# EAGLE design femtoUSB_r1.0.0_TQFP_BREADBOARD (EAGLE 6.5.0)
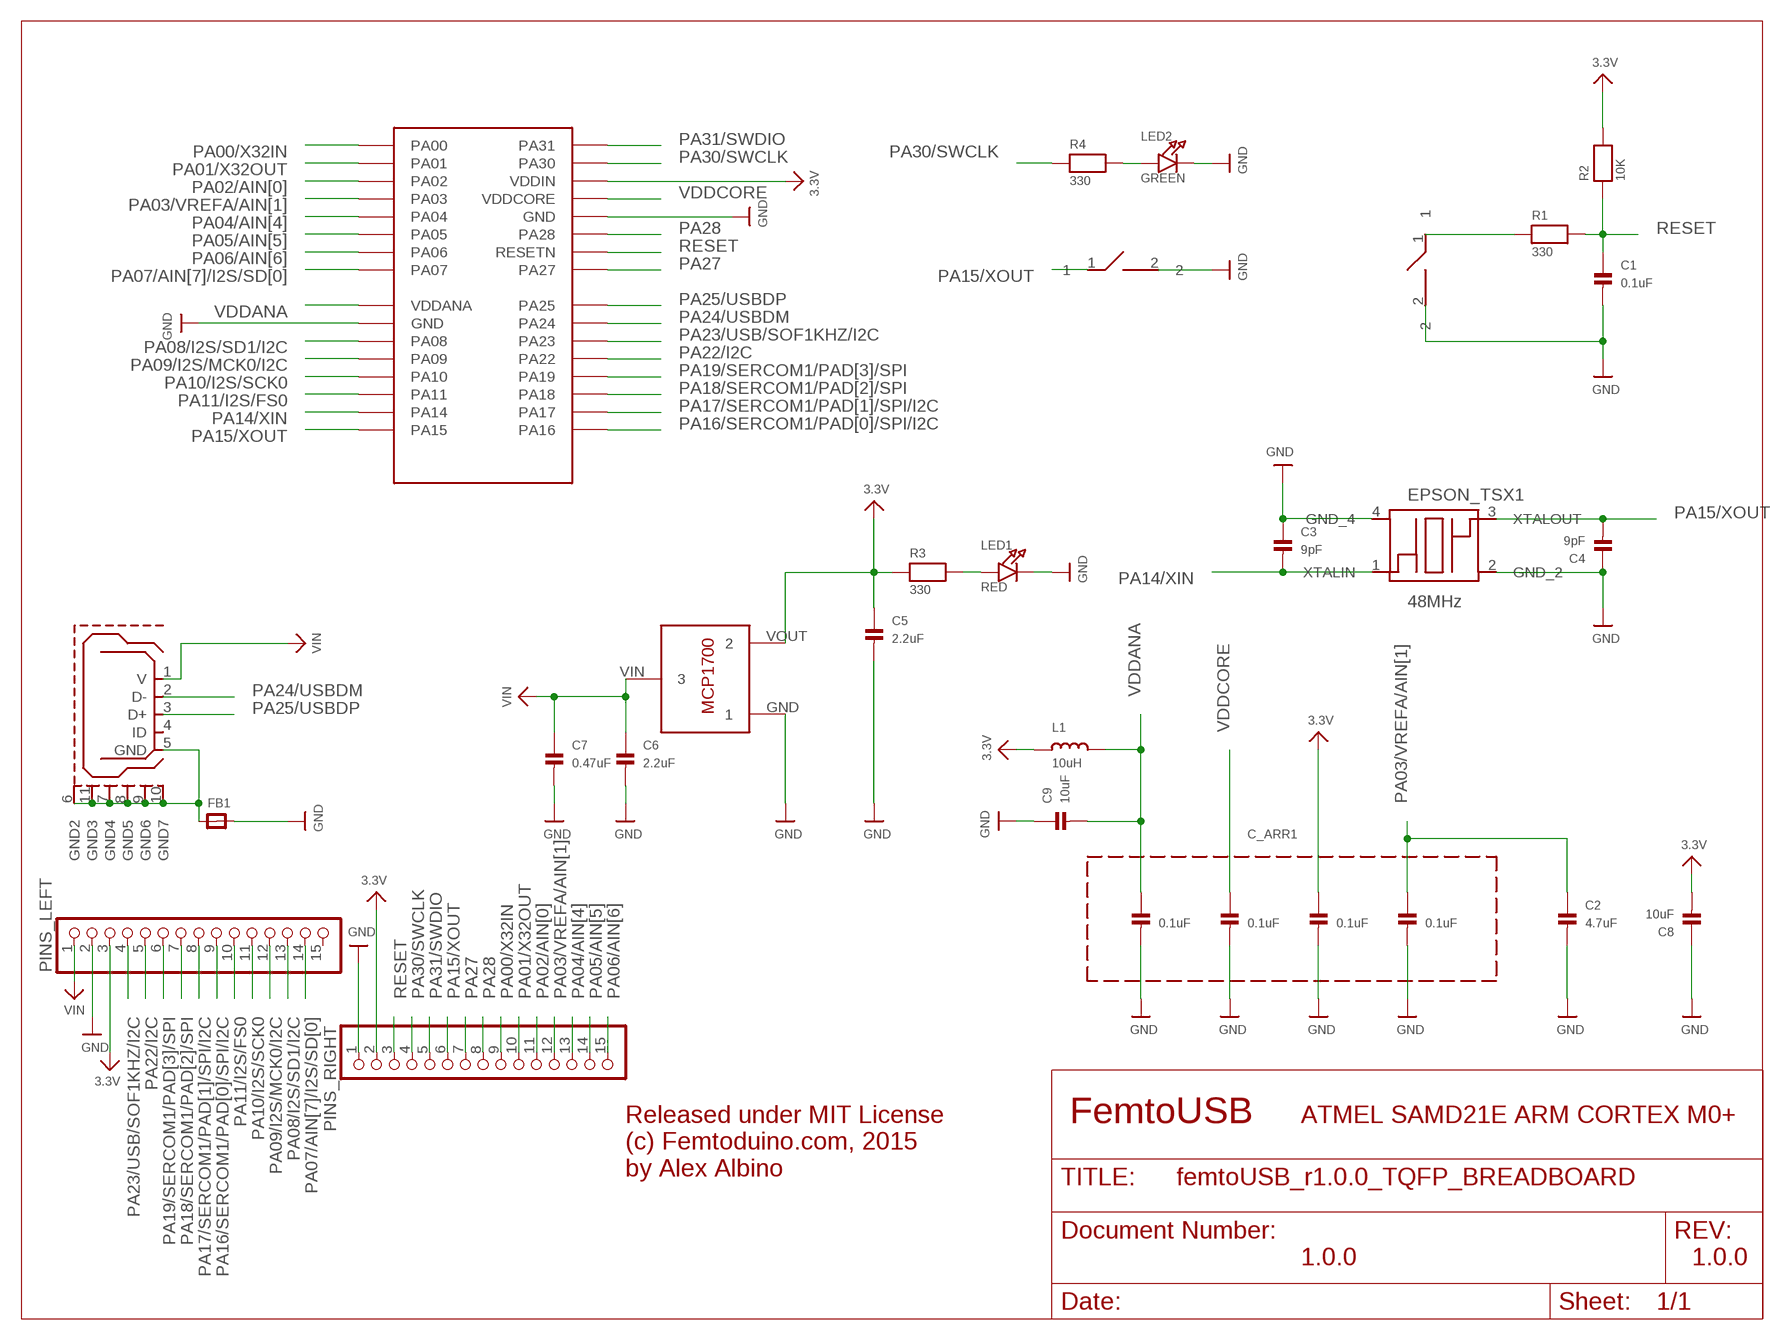
[diagram p0: schematic, sheet 1]

## Parts
BTN  OMRON B3U-300P(M)  SPST_SMD  [SPST_SMD]
C1  0.1uF  CAP_CERAMIC_0402MP  [_0402MP]
C2  4.7uF  CAP_CERAMIC_0402MP  [_0402MP]
C3  9pF  CAP_CERAMIC_0402MP  [_0402MP]
C4  9pF  CAP_CERAMIC_0402MP  [_0402MP]
C5  2.2uF  CAP_CERAMIC_0402MP  [_0402MP]
C6  2.2uF  CAP_CERAMIC_0402MP  [_0402MP]
C7  0.47uF  CAP_CERAMIC_0402MP  [_0402MP]
C8  10uF  CAP_CERAMIC_0402MP  [_0402MP]
C9  10uF  CAP_CERAMIC_0402MP  [_0402MP]
C_ARR1  0.1uF  KEMET_CERAMIC_CAPACITOR_ARRAY_1X4  [CAPACITOR_ARRAY_1206_MONO_1X4]
EPSON_TSX1  48MHz  TSX-3225  [TSX-3225]
FB1  FERRITE_0603MP  [_0603MP]
IC1  ATSAMD21E18A-AU  [32-TQFP]
L1  10uH  INDUCTOR_0603MP  [_0603MP]
LDO_VREG  MCP1700T-3302E/TT  [MCP1700T-3302E/TT]
LED1  RED  LED0603_NOOUTLINE  [CHIPLED_0603_NOOUTLINE]
LED2  GREEN  LED0603_NOOUTLINE  [CHIPLED_0603_NOOUTLINE]
MICRO_B_USB  USB_MICROB  [USB_MICROB_PACKAGE]
PINS_LEFT  HEADER-1X15  [1X15_ROUND_70]
PINS_RIGHT  HEADER-1X15  [1X15_ROUND_70]
R1  330  RESISTOR_0402MP  [_0402MP]
R2  10K  RESISTOR_0402MP  [_0402MP]
R3  330  RESISTOR_0402MP  [_0402MP]
R4  330  RESISTOR_0402MP  [_0402MP]
U$38  SPST_SMD  [SPST_SMD]

## Nets
3.3V: C5.1 C8.2 C_ARR1.5 IC1.30(VDDIN) L1.1 LDO_VREG.VOUT PINS_LEFT.3 PINS_RIGHT.2 R2.2 R3.1
GND: BTN.2 C1.2 C2.2 C3.1 C4.1 C5.2 C6.2 C7.2 C8.1 C9.1 C_ARR1.2 C_ARR1.4 C_ARR1.6 C_ARR1.8 EPSON_TSX1.2(GND_2) EPSON_TSX1.4(GND_4) FB1.2 IC1.10(GND) IC1.28(GND) LDO_VREG.GND LED1.C LED2.C PINS_LEFT.2 PINS_RIGHT.1 U$38.2
N$1: LED1.A R3.2
N$13: LED2.A R4.2
N$26: BTN.1 R1.1
N$32: FB1.1 MICRO_B_USB.5(GND) MICRO_B_USB.6(GND2) MICRO_B_USB.7(GND4) MICRO_B_USB.8(GND5) MICRO_B_USB.9(GND6) MICRO_B_USB.10(GND7) MICRO_B_USB.11(GND3)
PA00/X32IN: IC1.1(PA00) PINS_RIGHT.9
PA01/X32OUT: IC1.2(PA01) PINS_RIGHT.10
PA02/AIN[0]: IC1.3(PA02) PINS_RIGHT.11
PA03/VREFA/AIN[1]: C2.1 C_ARR1.7 IC1.4(PA03) PINS_RIGHT.12
PA04/AIN[4]: IC1.5(PA04) PINS_RIGHT.13
PA05/AIN[5]: IC1.6(PA05) PINS_RIGHT.14
PA06/AIN[6]: IC1.7(PA06) PINS_RIGHT.15
PA07/AIN[7]/I2S/SD[0]: IC1.8(PA07) PINS_LEFT.14
PA08/I2S/SD1/I2C: IC1.11(PA08) PINS_LEFT.13
PA09/I2S/MCK0/I2C: IC1.12(PA09) PINS_LEFT.12
PA10/I2S/SCK0: IC1.13(PA10) PINS_LEFT.11
PA11/I2S/FS0: IC1.14(PA11) PINS_LEFT.10
PA14/XIN: C3.2 EPSON_TSX1.1(XTALIN) IC1.15(PA14)
PA15/XOUT: C4.2 EPSON_TSX1.3(XTALOUT) IC1.16(PA15) PINS_RIGHT.6 U$38.1
PA16/SERCOM1/PAD[0]/SPI/I2C: IC1.17(PA16) PINS_LEFT.9
PA17/SERCOM1/PAD[1]/SPI/I2C: IC1.18(PA17) PINS_LEFT.8
PA18/SERCOM1/PAD[2]/SPI: IC1.19(PA18) PINS_LEFT.7
PA19/SERCOM1/PAD[3]/SPI: IC1.20(PA19) PINS_LEFT.6
PA22/I2C: IC1.21(PA22) PINS_LEFT.5
PA23/USB/SOF1KHZ/I2C: IC1.22(PA23) PINS_LEFT.4
PA24/USBDM: IC1.23(PA24) MICRO_B_USB.2(D-)
PA25/USBDP: IC1.24(PA25) MICRO_B_USB.3(D+)
PA27: IC1.25(PA27) PINS_RIGHT.7
PA28: IC1.27(PA28) PINS_RIGHT.8
PA30/SWCLK: IC1.31(PA30) PINS_RIGHT.4 R4.1
PA31/SWDIO: IC1.32(PA31) PINS_RIGHT.5
RESET: C1.1 IC1.26(RESETN) PINS_RIGHT.3 R1.2 R2.1
VDDANA: C9.2 C_ARR1.1 IC1.9(VDDANA) L1.2
VDDCORE: C_ARR1.3 IC1.29(VDDCORE)
VIN: C6.1 C7.1 LDO_VREG.VIN MICRO_B_USB.1(V) PINS_LEFT.1
Unconnected: MICRO_B_USB.4(ID) PINS_LEFT.15

## Notes on the sheet
- FemtoUSB | ATMEL SAMD21E ARM CORTEX M0+
- Released under MIT License
  (c) Femtoduino.com, 2015
  by Alex Albino
- 1.0.0 | 1.0.0

## Library data of the parts
BTN U$38 = femtoduino:SPST_SMD
C1 = microbuilder:CAP_CERAMIC: Ceramic Capacitors 0402 - 0402 Surface Mount Capacitors 16pF 50V 5% [Digikey: 445-4899-2-ND] 18pF 50V 5% [Digikey: 490-1281-2-ND] 22pF 50V 5% [Digikey: 490-1283-2-ND] 68pF 50V 5% [Digikey: 490-1289-2-ND] 0.1uF 10V 10% [Digikey: 490-1318-2-ND] 1.0uF 6.3V 10% [Digikey: 490-1320-2-ND] 0603 - 0603 Surface Mount Capacitors 16 pF 50V 5% [Digikey: 445-5051-2-ND] 22 pF 50V [Digikey: PCC220ACVTR-ND] 33 pF 50V 5% [Digikey: 490-1415-1-ND] 56pF 50V 5% [Digikey: 490-1421-1-ND] 220pF 50V 5% [Digikey: 445-1285-1-ND] 680 pF 50V 2200 pF 50V 5% C0G [Digikey: 445-1297-1-ND] 5600 pF 100V 5% X7R [Digikey: 478-3711-1-ND] 0.1 µF 25V 10% [Digikey: PCC2277TR-ND] 0.22 µF 16V 10% X7R [Digikey: 445-1318-1-ND] 1.0 µF 25V 10% [Digikey: 445-5146-2-ND] 0603 - RF Specific 3pF 250V +/-0.1pF RF [Digikey: 712-1347-1-ND] 18 pF 250V 5% [Digikey: 478-3505-1-ND or 712-1322-1-ND] 56 pF 250V 5% C0G RF [Digikey: 490-4867-1-ND] 68 pF 250V RF [Digikey: 490-4868-1-ND] 0805 - 0805 Surface Mount Capacitors 220 pF 250V 2% RF Ceramic Capacitor [Digikey: 712-1398-1-ND] 1000 pF 50V 2% NP0 Ceramic Capacitor [Digikey: 478-3760-1-ND] 0.1 µF 25V 10% Ceramic Capacitor [Digikey: PCC1828TR-ND] 1.0 µF 16V 10% Ceramic Capacitor[Digikey: 490-1691-2-ND] 10.0 µF 10V 10% Ceramic Capacitor[Digikey: 709-1228-1-ND] 10.0 uF 16V 10% Ceramic Capacitor [Digikey: 478-5165-2-ND] 47 uF 6.3V 20% Ceramic Capacitor [Digikey: 587-1779-1-ND or 399-5506-1-ND] 1206 - 1206 Surface Mount Capacitors 47uF 10V 20% Ceramic Capacitor [Digikey: 490-5528-1-ND or 399-5508-1-ND or 445-6010-1-ND] 100uF 6.3V -20%, +80% Y5V Ceramic Capacitor (Digikey: 490-4512-1-ND, Mouser: 81-GRM31CF50J107ZE1L); DIGIKEY_PART: 445-4958-1-ND
C2-C9 = microbuilder:CAP_CERAMIC: Ceramic Capacitors 0402 - 0402 Surface Mount Capacitors 16pF 50V 5% [Digikey: 445-4899-2-ND] 18pF 50V 5% [Digikey: 490-1281-2-ND] 22pF 50V 5% [Digikey: 490-1283-2-ND] 68pF 50V 5% [Digikey: 490-1289-2-ND] 0.1uF 10V 10% [Digikey: 490-1318-2-ND] 1.0uF 6.3V 10% [Digikey: 490-1320-2-ND] 0603 - 0603 Surface Mount Capacitors 16 pF 50V 5% [Digikey: 445-5051-2-ND] 22 pF 50V [Digikey: PCC220ACVTR-ND] 33 pF 50V 5% [Digikey: 490-1415-1-ND] 56pF 50V 5% [Digikey: 490-1421-1-ND] 220pF 50V 5% [Digikey: 445-1285-1-ND] 680 pF 50V 2200 pF 50V 5% C0G [Digikey: 445-1297-1-ND] 5600 pF 100V 5% X7R [Digikey: 478-3711-1-ND] 0.1 µF 25V 10% [Digikey: PCC2277TR-ND] 0.22 µF 16V 10% X7R [Digikey: 445-1318-1-ND] 1.0 µF 25V 10% [Digikey: 445-5146-2-ND] 0603 - RF Specific 3pF 250V +/-0.1pF RF [Digikey: 712-1347-1-ND] 18 pF 250V 5% [Digikey: 478-3505-1-ND or 712-1322-1-ND] 56 pF 250V 5% C0G RF [Digikey: 490-4867-1-ND] 68 pF 250V RF [Digikey: 490-4868-1-ND] 0805 - 0805 Surface Mount Capacitors 220 pF 250V 2% RF Ceramic Capacitor [Digikey: 712-1398-1-ND] 1000 pF 50V 2% NP0 Ceramic Capacitor [Digikey: 478-3760-1-ND] 0.1 µF 25V 10% Ceramic Capacitor [Digikey: PCC1828TR-ND] 1.0 µF 16V 10% Ceramic Capacitor[Digikey: 490-1691-2-ND] 10.0 µF 10V 10% Ceramic Capacitor[Digikey: 709-1228-1-ND] 10.0 uF 16V 10% Ceramic Capacitor [Digikey: 478-5165-2-ND] 47 uF 6.3V 20% Ceramic Capacitor [Digikey: 587-1779-1-ND or 399-5506-1-ND] 1206 - 1206 Surface Mount Capacitors 47uF 10V 20% Ceramic Capacitor [Digikey: 490-5528-1-ND or 399-5508-1-ND or 445-6010-1-ND] 100uF 6.3V -20%, +80% Y5V Ceramic Capacitor (Digikey: 490-4512-1-ND, Mouser: 81-GRM31CF50J107ZE1L)
C_ARR1 = array-capacitor:KEMET_CERAMIC_CAPACITOR_ARRAY_1X4
EPSON_TSX1 = crystals:TSX-3225; DIGIKEY_PART: TSX-3225 32.0000MF15X-B-ND
FB1 = microbuilder:FERRITE: Ferrite Bead 0603 MMZ1608B121C - 120 Ohm @ 100MHz, 600mA, 0.15 Ohm DC Resistance - Digikey: 445-2164-1-ND BK1608HW121-T - 120 Ohm, 600mA Ferrite Chip - Digikey: 587-1876-2-ND 0805 HZ0805B272R-10 - 2.7K Ohm @ 100MHz, 200mA, 0.8 Ohm DC Resistance - Digikey: 240-2504-1-ND (see also Murata BLM21BD272SN1L) MMZ2012Y152B - 1.5K Ohm @ 100MHz, 500mA, 0.4 Ohm DC Resistance - Digikey: 445-1560-1-ND - Mainly for high frequency (80-400MHz) MMZ2012R102A - 1K Ohm @ 100MHz, 500mA, 0.3 Ohm DC Resistance - Digikey: 445-1555-2-ND - More general purpose (10-200MHz)
IC1 = atmel-samd21:ATSAMD21E18A-AU; DIGIKEY_PART: ATSAMD21E18A-AU-ND
L1 = microbuilder:INDUCTOR: Inductors 0603: 10nH Ceramic Inductor - microwire antenna/RF (Digikey: 712-1434-2-ND) 0805: 560nH Ceramic Inductor - RF (Digikey: 553-1047-1-ND) 270nH Ceramic Inductor - Q = 40@250MHz, +-5%, 1 Ohm DC Resistance (Digikey: 535-10506-2-ND) 1007 (2518 Metric) SMT: 10µH 10% 250mOhm 820mA 1007 Inductor (Digikey: 587-2189-1-ND) 22µH 10% 500mOhm 580mA 1007 Inductor (Digikey: 587-2190-1-ND) 47µH 10% 950mOhm 420mA 1007 Inductor (Digikey: 587-2191-1-ND) 47µH 5% 100mOhm 1A 1008 Inductor (Digikey: 732-1816-1-ND) 5.0x5.0mm (Taiyo Yuden NR5040 Series) 6.8µH 20% 2.3A 64mOhm Inductor (Digikey: 587-2374-2-ND) 5.0x5.0mm (TDK VLC5045 Series) 4.7µH 20% 3.3A 34mOhm Inductor (Digikey: 445-6526-1-ND) 6.8µH 20% 2.7A 46mOhm Inductor (Digikey: 445-6527-1-ND) 6.0x6.0mm (TDK VLC6045 Series) 4.7µH 20% 3.8A 27mOhm Inductor (Digikey: 445-6538-2-ND) 6.8µH 20% 3A 41mOhm Inductor (Digikey: 445-6540-1-ND) 6.2µH 30% 2.2A 45mOhm Inductor (Digikey: SRR5028-6R2YCT-ND) - Not TDK VLC6045 but footprint should match 6.0x6.0mm (TDK SLF6045 Series) 6.8uH 30% 2A 33mOhm Inductor (Digikey: 445-4572-1-ND, Mouser: 810-SLF645T6R8N2R0PF)
LDO_VREG = MCP1700T-3302E_TT:MCP1700T-3302E/TT: Microchip LDO "MCP1700" in a 3-Pin SOT-23 package. ID: MCP1700T-3302E/TT
LED1 LED2 = microbuilder:LED: LED 0603 - 0603 Surface Mount Package 2mA: Green LED - Low Power (3.9mcd, 2ma, 1.7Vf) - Digikey: 475-2709-2-ND Orange LED - Low Power (9.8mcd, 2ma, 1.8Vf) - Digikey: 475-1194-2-ND Red LED - Low Power (5mcd, 2ma, 1.8Vf) - Digikey: 475-1195-2-ND Yellow LED - Low Power (7mcd, 2ma, 1.8Vf) - Digikey: 475-1196-2-ND 5mA: Blue LED - Low Power (17mcd, 5ma, 2.9Vf) - Digikey: LNJ937W8CRACT-ND 0805 - 0805 Surface Mount Package 2mA: Red LED (8.8mcd, 2mA, 1.8Vf, Clear) - Low Power [Digikey: 475-2510-1-ND] Green LED (5mcd, 2mA, 1.8Vf, Clear) - Low Power [Digikey: 475-2730-1-ND] Yellow LED (11.3mcd, 2mA, 1.8Vf, Clear) - Low Power [Digikey: 475-2555-1-ND] 20mA: Red LED (104mcd, 20mA, Diffused) - LS R976 [Digikey: 475-1278-6-ND] Red LED (12mcd, 20mA, 2.0Vf, Clear) - APT2012EC [Digikey: 754-1128-1-ND] Green LED (15mcd, 20mA, 2.2Vf, Clear) - APT2012GC [Digikey: 754-1131-1-ND] Orange LED (160mcd, 20mA, 2.1Vf, Clear) - APT2012SECK [Digikey: 754-1130-1-ND] 1206 - 1206 Surface Mount Package Green LED (26mcd, 20mA, Diffused) - LG N971 [Digikey: 475-1407-6-ND] Red LED (15mcd, 20mA, Diffused) - LH N974 [Digikey: 475-1416-6-ND]
MICRO_B_USB = femtoduino:USB_MICROB: This is the hirose ZX62-B-5PA(11) MICRO-USB B Type female connection.
PINS_LEFT PINS_RIGHT = microbuilder:HEADER-1X15: 1x15 Header
R1 = microbuilder:RESISTOR: Resistors 0402 - 0402 Surface Mount Package 22 Ohm 1% 1/16W [Digikey: 311-22.0LRTR-ND] 33 Ohm 5% 1/16W 1.0K 5% 1/16W 1.5K 5% 1/16W 2.0K 1% 1/16W 10.0K 1% 1/16W [Digikey: 311-10.0KLRTR-ND] 10.0K 5% 1/16W [Digikey: RMCF0402JT10K0TR-ND] 12.1K 1% 1/16W [Digikey: 311-22.0LRTR-ND] 100.0K 5% 1/16W 0603 - 0603 Surface Mount Package 0 Ohm 1/10 Watt 1% Resistor 15 Ohm 1/10 Watt 1% Resistor 33 Ohm 1/10 Watt 1% Resistor 49.9 Ohm 1/10 Watt 1% Resistor 100 Ohm 1/10 Watt 1% Resistor 150 Ohm 1/10 Watt 1% Resistor 240 Ohm 1/10 Watt 1% Resistor 390 Ohm 1/10 Watt 1% Resistor 560 Ohm 1/10 Watt 1% Resistor 680 Ohm 1/10 Watt 1% Resistor 750 Ohm 1/10 Watt 1% Resistor 1.0K Ohm 1/10 Watt 1% Resistor 1.5K Ohm 1/10 Watt 1% Resistor 2.0K Ohm 1/10 Watt 1% Resistor 2.2K Ohm 1/10 Watt 1% Resistor 3.3K Ohm 1/10 Watt 1% Resistor 4.7K Ohm 1/10 Watt 1% Resistor 10.0K Ohm 1/10 Watt 1% Resistor 12.0K Ohm 1/10 Watt 1% Resistor 12.1K Ohm 1/10 Watt 1% Resistor 20.0K Ohm 1/10 Watt 1% Resistor 33.0K Ohm 1/10 Watt 1% Resistor 100.0K Ohm 1/10 Watt 1% Resistor 0805 - 0805 Surface Mount Package 0 Ohm 1/8 Watt 1% Resistor 33 Ohm 1/8 Watt 1% Resistor 100 Ohm 1/8 Watt 1% Resistor 150 Ohm 1/8 Watt 1% Resistor 200 Ohm 1/8 Watt 1% Resistor 240 Ohm 1/8 Watt 1% Resistor 330 Ohm 1/8 Watt 1% Resistor 390 Ohm 1/8 Watt 1% Resistor 470 Ohm 1/8 Watt 1% Resistor 1.0K Ohm 1/8 Watt 1% Resistor 1.5K Ohm 1/8 Watt 1% Resistor 2.0K Ohm 1/8 Watt 1% Resistor 4.7K Ohm 1/8 Watt 1% Resistor 5.1K Ohm 1/8 Watt 1% Resistor 5.6K Ohm 1/8 Watt 1% Resistor 10.0K Ohm 1/8 Watt 1% Resistor 22.0K Ohm 1/8 Watt 1% Resistor 33.0K Ohm 1/8 Watt 1% Resistor 100K Ohm 1/8 Watt 1% Resistor 1206 - 1206 Surface Mount Package 2012 - 2010 Surface Mount Package 0.11 Ohm 1/2 Watt 1% Resistor - Digikey: RHM.11UCT-ND; DIGIKEY_PART: 541-330JCT-ND
R2-R4 = microbuilder:RESISTOR: Resistors 0402 - 0402 Surface Mount Package 22 Ohm 1% 1/16W [Digikey: 311-22.0LRTR-ND] 33 Ohm 5% 1/16W 1.0K 5% 1/16W 1.5K 5% 1/16W 2.0K 1% 1/16W 10.0K 1% 1/16W [Digikey: 311-10.0KLRTR-ND] 10.0K 5% 1/16W [Digikey: RMCF0402JT10K0TR-ND] 12.1K 1% 1/16W [Digikey: 311-22.0LRTR-ND] 100.0K 5% 1/16W 0603 - 0603 Surface Mount Package 0 Ohm 1/10 Watt 1% Resistor 15 Ohm 1/10 Watt 1% Resistor 33 Ohm 1/10 Watt 1% Resistor 49.9 Ohm 1/10 Watt 1% Resistor 100 Ohm 1/10 Watt 1% Resistor 150 Ohm 1/10 Watt 1% Resistor 240 Ohm 1/10 Watt 1% Resistor 390 Ohm 1/10 Watt 1% Resistor 560 Ohm 1/10 Watt 1% Resistor 680 Ohm 1/10 Watt 1% Resistor 750 Ohm 1/10 Watt 1% Resistor 1.0K Ohm 1/10 Watt 1% Resistor 1.5K Ohm 1/10 Watt 1% Resistor 2.0K Ohm 1/10 Watt 1% Resistor 2.2K Ohm 1/10 Watt 1% Resistor 3.3K Ohm 1/10 Watt 1% Resistor 4.7K Ohm 1/10 Watt 1% Resistor 10.0K Ohm 1/10 Watt 1% Resistor 12.0K Ohm 1/10 Watt 1% Resistor 12.1K Ohm 1/10 Watt 1% Resistor 20.0K Ohm 1/10 Watt 1% Resistor 33.0K Ohm 1/10 Watt 1% Resistor 100.0K Ohm 1/10 Watt 1% Resistor 0805 - 0805 Surface Mount Package 0 Ohm 1/8 Watt 1% Resistor 33 Ohm 1/8 Watt 1% Resistor 100 Ohm 1/8 Watt 1% Resistor 150 Ohm 1/8 Watt 1% Resistor 200 Ohm 1/8 Watt 1% Resistor 240 Ohm 1/8 Watt 1% Resistor 330 Ohm 1/8 Watt 1% Resistor 390 Ohm 1/8 Watt 1% Resistor 470 Ohm 1/8 Watt 1% Resistor 1.0K Ohm 1/8 Watt 1% Resistor 1.5K Ohm 1/8 Watt 1% Resistor 2.0K Ohm 1/8 Watt 1% Resistor 4.7K Ohm 1/8 Watt 1% Resistor 5.1K Ohm 1/8 Watt 1% Resistor 5.6K Ohm 1/8 Watt 1% Resistor 10.0K Ohm 1/8 Watt 1% Resistor 22.0K Ohm 1/8 Watt 1% Resistor 33.0K Ohm 1/8 Watt 1% Resistor 100K Ohm 1/8 Watt 1% Resistor 1206 - 1206 Surface Mount Package 2012 - 2010 Surface Mount Package 0.11 Ohm 1/2 Watt 1% Resistor - Digikey: RHM.11UCT-ND

## Board
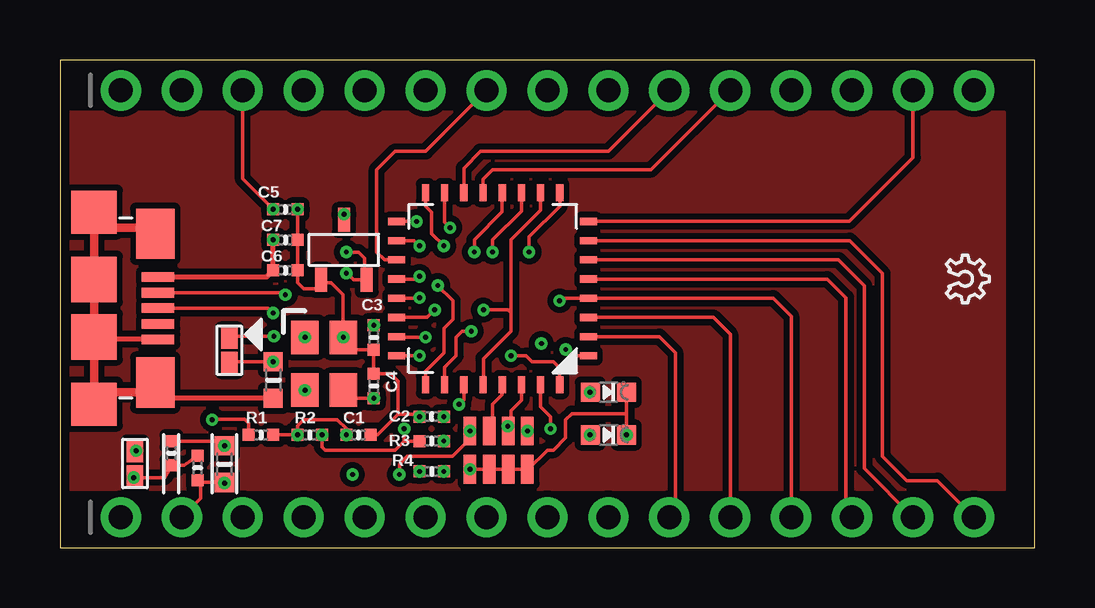
[diagram p1: board, top side]
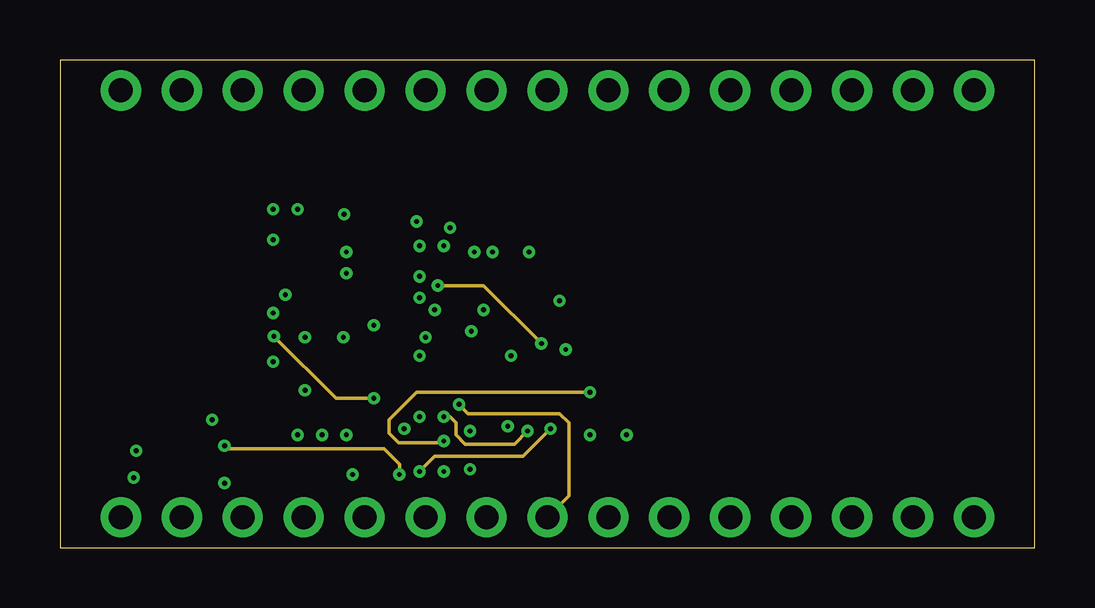
[diagram p2: board, inner layer Route2]
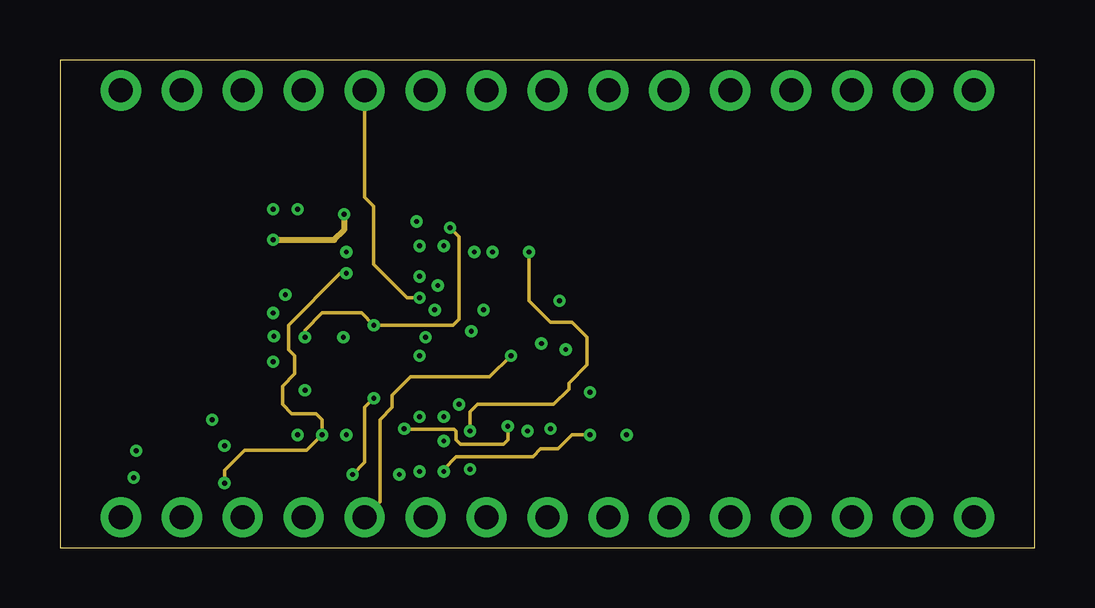
[diagram p3: board, inner layer Route15]
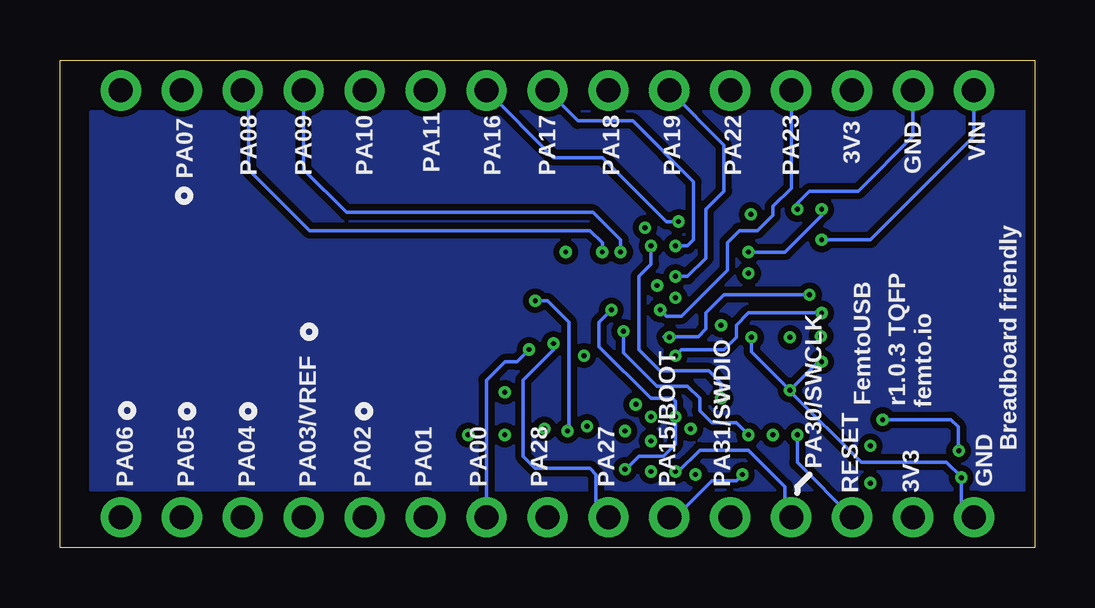
[diagram p4: board, bottom side, seen from below]

Size 40.64 x 20.32 mm. Coordinates in mm from the lower left corner, seen from the top.
Outline: 0,0 40.64,0 40.64,20.32 0,20.32 0,0
Copper layers (1+2*15+16): Top 0.035mm / dielectric 0.7mm / Route2 0.035mm / dielectric 0.15mm / Route15 0.035mm / dielectric 0.2mm / Bottom 0.035mm
Design rules "AQS_custom_4layer": minimum track width 5mil, minimum drill 5mil, track to track 6mil, track to pad 6mil, pad to pad 6mil, via to via 6mil, smd to smd 1mil, copper to edge 15mil, drill to drill 6mil, minimum pad ring 7mil, minimum via ring 3mil, stop-mask expansion 2mil, vias tented up to drill 10mil, thermal gap 10mil

### Footprints (pad centres in the part's own frame; a part is rotated, then mirrored left to right if it is on the bottom)
SPST_SMD = smd 0.889 x 0.699: 1 -0.508,0; 2 0.508,0
_0402MP = smd 0.5 x 0.5: 1 -0.508,0; 2 0.508,0
CAPACITOR_ARRAY_1206_MONO_1X4 = smd 0.52 x 1.2: 1 -1.2,0.8; 2 -1.2,-0.8; 3 -0.4,0.8; 4 -0.4,-0.8; 5 0.4,0.8; 6 0.4,-0.8; 7 1.2,0.8; 8 1.2,-0.8
TSX-3225 = smd 1.4 x 1.15: 1 0,-1.6; 2 2.2,-1.6; 3 2.2,0; 4 0,0
_0603MP = smd 0.8 x 0.8: 1 -0.762,0; 2 0.762,0
32-TQFP = smd 0.7 x 0.3: 1 -4,2.8; 2 -4,2; 3 -4,1.2; 4 -4,0.4; 5 -4,-0.4; 6 -4,-1.2; 7 -4,-2; 8 -4,-2.8; 17 4,-2.8; 18 4,-2; 19 4,-1.2; 20 4,-0.4; 21 4,0.4; 22 4,1.2; 23 4,2; 24 4,2.8 | smd 0.3 x 0.7: 9 -2.8,-4; 10 -2,-4; 11 -1.2,-4; 12 -0.4,-4; 13 0.4,-4; 14 1.2,-4; 15 2,-4; 16 2.8,-4; 25 2.8,4; 26 2,4; 27 1.2,4; 28 0.4,4; 29 -0.4,4; 30 -1.2,4; 31 -2,4; 32 -2.8,4
MCP1700T-3302E/TT = smd 0.5 x 1: GND 0.5,-0.6; VIN 1.45,1.9; VOUT 2.4,-0.6
CHIPLED_0603_NOOUTLINE = smd 0.8 x 0.8: A 0,-0.75; C 0,0.75
USB_MICROB_PACKAGE = smd 0.4 x 1.35: 1 -1.3,-0.68; 2 -0.64,-0.68; 3 0,-0.68; 4 0.66,-0.68; 5 1.3,-0.68 | smd 2.1 x 1.6: 6 -3.1,-0.8; 11 3.1,-0.8 | smd 1.8 x 1.9: 7 -4,-3.35; 10 4,-3.35 | smd 1.9 x 1.9: 8 -1.2,-3.35; 9 1.2,-3.35
1X15_ROUND_70 = drill 1 pad 1.676: 1 -17.78,0; 2 -15.24,0; 3 -12.7,0; 4 -10.16,0; 5 -7.62,0; 6 -5.08,0; 7 -2.54,0; 8 0,0; 9 2.54,0; 10 5.08,0; 11 7.62,0; 12 10.16,0; 13 12.7,0; 14 15.24,0; 15 17.78,0

### Placement (x,y rotation side)
BTN  3.12,3.51 270 top
C1  12.45,4.7 0 top
C2  15.49,5.46 180 top
C3  13.08,8.76 90 top
C4  13.08,6.73 270 top
C5  9.4,14.1 0 top
C6  9.4,11.56 0 top
C7  9.4,12.83 0 top
C8  5.74,3.33 270 top
C9  4.65,3.94 90 top
C_ARR1  18.29,4.06 0 top
EPSON_TSX1  11.81,8.76 270 top
FB1  8.89,6.99 90 top
IC1  18.03,10.79 180 top
L1  6.86,3.48 90 top
LDO_VREG  10.39,11.76 0 top
LED1  22.86,6.48 270 top
LED2  22.86,4.7 270 top
MICRO_B_USB  4.77,9.98 270 top
PINS_LEFT  20.32,19.05 0 top
PINS_RIGHT  20.32,1.27 0 top
R1  8.38,4.7 0 top
R2  10.41,4.7 0 top
R3  15.49,4.45 0 top
R4  15.49,3.17 0 top
U$35  [OSHW_6X70_NOTEXT]  36.96,12.19 270 top
U$38  7.06,8.23 270 top

### Tracks (layer width: path | path; a pad name or v marks a point on that pad's centre or on a via)
3.3V  (via drill 0.2 pad 0.51)
  Top 0.152: C5.1 7.62,15.37 PINS_LEFT.3 | v11.94,12.32 12.45,12.32 12.7,12.06 12.7,11.15 LDO_VREG.VOUT 12.24,11.16 v11.94,11.43 | R3.1 14.35,4.45 | 14.35,4.45 13.97,4.06 11.05,4.06 10.92,4.19 R2.2 | C8.2 5.87,2.72 | 5.87,2.72 L1.1 v6.86,2.69 6.86,2.56 | IC1.30 19.23,6.15 18.8,5.71 18.8,5.1 18.69,4.99 C_ARR1.5 18.67,4.88 v18.67,5.05 | 14.35,4.45 v14.35,4.95 | 5.87,2.72 5.87,2.06 PINS_RIGHT.2
  Route15 0.152: v11.94,11.43 11.68,11.43 9.53,9.27 9.53,8.26 9.78,8 9.78,7.24 9.27,6.73 9.27,5.97 9.65,5.59 10.67,5.59 10.92,5.33 R2.2 10.29,4.06 7.7,4.06 6.86,3.23 v6.86,2.69 | v18.67,5.05 18.67,4.5 18.49,4.32 16.69,4.32 16.51,4.5 16.51,4.85 16.43,4.93 14.4,4.93 v14.35,4.95
  Bottom 0.152: C5.1 8.89,13.84 10.41,12.32 v11.94,12.32
  other vias: 10.92,4.7 8.89,14.1
GND  (via drill 0.2 pad 0.51)
  Top 0.152: IC1.10 20.03,14.06 18.8,12.83 18.8,9.78 | C1.2 13.23,4.7 14.1,5.56 | 14.1,5.56 14.1,6.93 13.79,7.24 C4.1 C3.1 12.32,8.26 EPSON_TSX1.4 11.81,10.54 11.3,11.05 10.9,11.05 LDO_VREG.GND 10.86,10.79 10.16,10.79 9.91,11.05 C6.2 C7.2 C5.2 | LED1.C 23.61,5.59 | 23.61,5.59 LED2.C v23.62,4.7 23.61,4.46 | 18.8,9.78 18.8,9.02 17.65,7.87 17.65,6.81 IC1.28 | v17.65,9.91 18.67,9.91 18.8,9.78 | C_ARR1.2 C_ARR1.4 C_ARR1.6 C_ARR1.8 19.52,3.26 20.32,4.06 20.57,4.06 21.08,4.57 21.08,5.33 21.34,5.59 23.61,5.59 | BTN.2 v3.07,2.92 4.34,2.92 C9.1 5.18,3.43 C8.1 | 14.1,5.56 14.99,5.56 C2.2 | U$38.2 7.09,7.75 FB1.2
  Bottom 0.152: C5.2 9.91,14.35 9.4,14.86 7.37,14.86 5.08,17.14 PINS_LEFT.2 | EPSON_TSX1.4 11.81,8.16 EPSON_TSX1.2 | EPSON_TSX1.2 9.03,7.75 FB1.2 8.87,7.77 | EPSON_TSX1.2 10.21,6.53 7.24,3.56 3.68,3.56 3.07,2.95 v3.07,2.92 3.07,1.8 PINS_RIGHT.1 | C_ARR1.2 17.06,3.26 16.51,3.81 15.49,3.81 14.99,4.32 C2.2 14.99,6.1 15.11,6.22 16,6.22 18.16,8.38 18.16,9.4 v17.65,9.91
  other vias: 10.21,6.56 8.89,7.75 9.91,14.1 11.81,8.76 14.99,5.46 17.09,3.26
N$1  (via drill 0.2 pad 0.51)
  Top 0.152: LED1.A v22.1,6.48
  Route2 0.152: v22.1,6.48 14.86,6.48 13.72,5.33 13.72,4.78 14.12,4.37 15.93,4.37 R3.2
  other vias: 16,4.45
N$2
  pour Top (isolate 0.254): 0.25,18.16 39.37,18.16 39.37,2.41 0.25,2.41
  pour Bottom (isolate 0.254): 0.25,18.16 39.37,18.16 39.37,2.41 0.25,2.41
N$13  (via drill 0.2 pad 0.51)
  Top 0.152: LED2.A v22.1,4.7
  Route15 0.152: R4.2 16,3.28 16.51,3.79 19.71,3.79 20.04,4.12 20.75,4.12 21.34,4.7 v22.1,4.7
  other vias: 16,3.17
N$26  (via drill 0.2 pad 0.51)
  Top 0.152: R1.1 7.87,5.18 7.7,5.36 6.38,5.36 v6.35,5.33 | BTN.1 v3.17,4.04
  Bottom 0.152: v6.35,5.33 3.5,5.33 3.2,5.03 3.2,4.12 v3.17,4.04
N$32
  Top 0.203: MICRO_B_USB.5 1.42,8.68 MICRO_B_USB.9 | FB1.1 4.63,6.22 MICRO_B_USB.11
  Top 0.356: MICRO_B_USB.7 1.42,13.34 | 1.42,13.34 MICRO_B_USB.8 MICRO_B_USB.9 1.42,6.48 | 1.42,6.48 MICRO_B_USB.10 | MICRO_B_USB.11 3.97,6.48 1.42,6.48 | MICRO_B_USB.6 3.97,13.34 1.42,13.34
PA00/X32IN  (via drill 0.2 pad 0.51)
  Top 0.152: IC1.1 21.34,8 v21.08,8.26
  Bottom 0.152: v21.08,8.26 21.59,7.75 22.1,7.75 22.86,6.99 PINS_RIGHT.9
PA01/X32OUT
  Top 0.152: IC1.2 24.99,8.79 25.65,8.13 25.65,1.52 PINS_RIGHT.10
PA02/AIN[0]
  Top 0.152: IC1.3 27.23,9.6 27.94,8.89 PINS_RIGHT.11
PA03/VREFA/AIN[1]  (via drill 0.2 pad 0.51)
  Top 0.152: v20.83,10.29 20.94,10.39 IC1.4 29.74,10.39 30.48,9.65 PINS_RIGHT.12
  Route2 0.152: C2.1 16.26,5.46 16.51,5.21 16.51,4.7 16.89,4.32 18.94,4.32 C_ARR1.7
  Bottom 0.152: v20.83,10.29 20.32,10.29 19.43,9.4 19.43,4.92 C_ARR1.7
  other vias: 19.49,4.86 16,5.46
PA04/AIN[4]
  Top 0.152: IC1.5 31.98,11.2 32.77,10.41 32.77,1.52 PINS_RIGHT.13
PA05/AIN[5]
  Top 0.152: IC1.6 32.45,11.99 33.53,10.92 33.53,3.3 PINS_RIGHT.14
PA06/AIN[6]
  Top 0.152: IC1.7 32.92,12.79 34.29,11.43 34.29,3.81 35.31,2.79 36.58,2.79 PINS_RIGHT.15
PA07/AIN[7]/I2S/SD[0]
  Top 0.152: IC1.8 32.9,13.6 35.56,16.26 PINS_LEFT.14
PA08/I2S/SD1/I2C  (via drill 0.2 pad 0.51)
  Top 0.152: IC1.11 19.23,14.03 18.03,12.83 v18.03,12.32
  Bottom 0.152: v18.03,12.32 18.03,12.7 18.54,13.21 30.23,13.21 32.77,15.75 32.77,18.8 PINS_LEFT.13
PA09/I2S/MCK0/I2C  (via drill 0.2 pad 0.51)
  Top 0.152: IC1.12 18.43,13.99 17.27,12.83 v17.27,12.32
  Bottom 0.152: v17.27,12.32 17.27,12.83 18.41,13.97 28.7,13.97 30.48,15.75 PINS_LEFT.12
PA10/I2S/SCK0
  Top 0.152: IC1.13 17.63,15.35 18.03,15.75 24.64,15.75 PINS_LEFT.11
PA11/I2S/FS0
  Top 0.152: IC1.14 16.83,15.82 17.53,16.51 22.86,16.51 PINS_LEFT.10
PA14/XIN  (via drill 0.2 pad 0.51)
  Top 0.152: IC1.15 16.03,13.56 v16.26,13.34
  Route15 0.152: EPSON_TSX1.1 10.21,9.07 10.92,9.78 12.57,9.78 C3.2 16.38,9.27 16.64,9.53 16.64,12.95 v16.26,13.34
  other vias: 10.21,8.76 13.08,9.27
PA15/XOUT  (via drill 0.2 pad 0.51)
  Top 0.152: IC1.16 15.23,14.23 15.49,13.97 15.49,13.08 v16,12.57 | C4.2 12.15,6.22 EPSON_TSX1.3 | U$38.1 7.14,8.81 v8.91,8.81
  Route2 0.152: v8.91,8.81 11.51,6.22 C4.2
  Route15 0.152: C4.2 12.7,5.84 12.7,3.56 v12.19,3.05
  Bottom 0.152: C4.2 13.08,6.86 13.59,7.37 15.62,7.37 16.51,8.26 16.51,11.3 16,11.81 v16,12.57 | v12.19,3.05 12.45,2.79 13.46,2.79 14.73,1.52 14.99,1.52 PINS_RIGHT.6
  other vias: 13.08,6.22
PA16/SERCOM1/PAD[0]/SPI/I2C  (via drill 0.2 pad 0.51)
  Top 0.152: IC1.17 v14.85,13.6 v14.86,13.59
  Bottom 0.152: v14.86,13.59 15.37,13.59 18.03,16.26 20.07,16.26 PINS_LEFT.9
PA17/SERCOM1/PAD[1]/SPI/I2C  (via drill 0.2 pad 0.51)
  Top 0.152: IC1.18 14.76,12.79 v14.99,12.57
  Bottom 0.152: v14.99,12.57 14.48,12.57 14.22,12.83 14.22,15.24 16.76,17.78 19.05,17.78 PINS_LEFT.8
PA18/SERCOM1/PAD[2]/SPI
  Top 0.152: IC1.19 13.53,11.99 13.21,12.32 13.21,15.75 13.97,16.51 15.24,16.51 PINS_LEFT.7
PA19/SERCOM1/PAD[3]/SPI  (via drill 0.2 pad 0.51)
  Top 0.152: IC1.20 14.88,11.2 v14.99,11.3
  Bottom 0.152: v14.99,11.3 14.48,11.3 13.72,12.06 13.72,14.1 12.95,14.86 12.95,16.76 PINS_LEFT.6
PA22/I2C  (via drill 0.2 pad 0.51)
  Top 0.152: IC1.21 14.97,10.39 v14.99,10.41
  Route15 0.152: v14.99,10.41 14.48,10.41 13.08,11.81 13.08,14.22 12.7,14.61 PINS_LEFT.5
PA23/USB/SOF1KHZ/I2C  (via drill 0.2 pad 0.51)
  Top 0.152: IC1.22 15.31,9.6 v15.62,9.91
  Bottom 0.152: v15.62,9.91 15.37,9.65 14.73,9.65 12.83,11.56 12.83,12.7 12.32,13.21 11.56,13.21 10.92,13.84 10.92,14.22 10.16,14.99 PINS_LEFT.4
PA24/USBDM  (via drill 0.2 pad 0.51)
  Top 0.152: MICRO_B_USB.2 9.32,10.62 v9.4,10.54 | v15.24,8.76 14.07,8.76 IC1.23
  Bottom 0.152: v9.4,10.54 12.95,10.54 13.72,9.78 13.72,9.11 IC1.23 15.46,8.79 v15.24,8.76
PA25/USBDP  (via drill 0.2 pad 0.51)
  Top 0.152: MICRO_B_USB.3 8.69,9.98 v8.89,9.78 | v14.99,8 IC1.24
  Bottom 0.152: v8.89,9.78 11.94,9.78 12.45,9.27 12.45,8.76 12.95,8.26 14.73,8.26 v14.99,8
PA27  (via drill 0.2 pad 0.51)
  Top 0.152: IC1.25 15.23,7.36 16,8.13 16,9.14 16.38,9.53 16.38,10.29 v15.75,10.92
  Route2 0.152: v15.75,10.92 17.65,10.92 v20.07,8.51
  Bottom 0.152: v20.07,8.51 20.07,8.26 21.34,6.99 21.34,3.81 20.83,3.3 18.54,3.3 18.29,3.05 18.29,1.78 PINS_RIGHT.7
PA28  (via drill 0.2 pad 0.51)
  Top 0.152: IC1.27 16.83,6.17 v16.64,5.97
  Route2 0.152: v16.64,5.97 17.02,5.59 20.83,5.59 21.21,5.21 21.21,2.16 PINS_RIGHT.8
PA30/SWCLK  (via drill 0.2 pad 0.51)
  Top 0.152: IC1.31 20.03,5.87 20.45,5.46 v20.45,4.95
  Route2 0.152: v20.45,4.95 19.3,3.81 15.62,3.81 R4.1
  Bottom 0.152: R4.1 14.86,3.17 13.97,4.06 11.94,4.06 10.41,2.54 10.41,1.52 PINS_RIGHT.4
  other vias: 14.99,3.17
PA31/SWDIO  (via drill 0.2 pad 0.51)
  Top 0.152: v18.8,8 19.43,8 19.68,7.75 20.57,7.75 20.83,7.49 IC1.32
  Route15 0.152: v18.8,8 17.91,7.11 14.61,7.11 13.84,6.35 13.84,5.84 13.34,5.33 13.34,1.91 PINS_RIGHT.5
RESET  (via drill 0.2 pad 0.51)
  Top 0.152: R1.2 R2.1 9.91,5.08 10.16,5.33 11.56,5.33 11.94,4.95 C1.1 | IC1.26 16.03,7.53 16.51,8 16.51,8.76 16.76,9.02 v17.14,9.02
  Bottom 0.152: v17.14,9.02 17.14,8.13 15.75,6.73 14.48,6.73 13.97,6.22 13.97,5.71 13.46,5.21 12.45,5.21 C1.1 | R2.1 9.91,3.56 PINS_RIGHT.3
  other vias: 9.91,4.7 11.94,4.7
VDDANA  (via drill 0.2 pad 0.51)
  Top 0.152: IC1.9 20.83,14.23 19.56,12.95 v19.56,12.32 | C9.2 6.66,4.45 L1.2 | v14.15,3.05 14.15,3.48 14.48,3.81 16.36,3.81 17.09,4.54 C_ARR1.1
  Route2 0.152: v14.15,3.05 14.15,3.48 13.51,4.12 6.99,4.12 L1.2
  Route15 0.152: v19.56,12.32 19.56,10.29 20.45,9.4 21.34,9.4 21.97,8.76 21.97,7.62 21.21,6.86 21.21,6.6 20.57,5.97 17.4,5.97 17.09,5.66 C_ARR1.1
  other vias: 17.09,4.86 6.86,4.24
VDDCORE
  Top 0.152: IC1.29 18.43,6.37 18.03,5.97 18.03,5.14 C_ARR1.3
VIN  (via drill 0.2 pad 0.51)
  Top 0.152: LDO_VREG.VIN v11.84,13.89
  Top 0.203: MICRO_B_USB.1 8.62,11.28 C6.1 C7.1
  Route15 0.254: C7.1 11.43,12.83 11.84,13.23 v11.84,13.89
  Bottom 0.152: C7.1 6.86,12.83 2.54,17.14 PINS_LEFT.1
  other vias: 8.89,12.83

### Text on the board
bNames: VIN | GND | 3V3 | PA23 | PA22 | PA19 | PA18 | PA17 | PA16 | PA11 | PA10 | PA09 | PA08 | PA07 | femto.io | r1.0.3 TQFP | FemtoUSB | Breadboard friendly | GND | PA30/SWCLK | PA31/SWDIO | PA15/BOOT | PA27 | PA28 | PA00 | PA01 | PA02 | PA03/VREF | PA04 | PA05 | PA06 | 3V3 | RESET